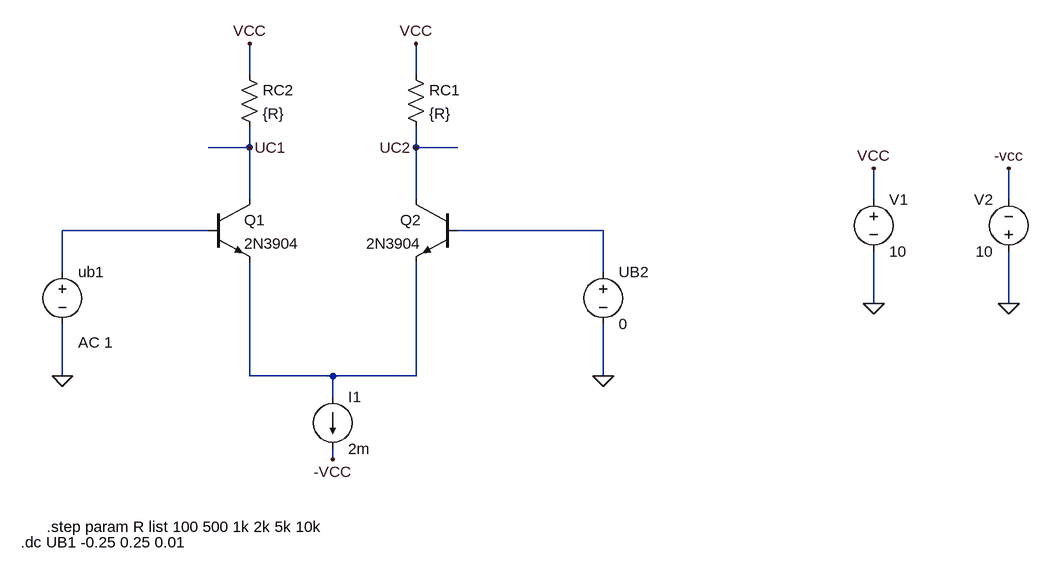
[diagram p0: schematic meros 4o B).asc]
meros 4o B).asc, the LTspice schematic file:
Version 4
SHEET 1 996 704
WIRE -208 -32 -208 -80
WIRE 48 -32 48 -80
WIRE -208 80 -208 48
WIRE -208 80 -272 80
WIRE 48 80 48 48
WIRE 112 80 48 80
WIRE -208 160 -208 80
WIRE 48 160 48 80
WIRE 752 160 752 112
WIRE 960 160 960 112
WIRE -272 208 -496 208
WIRE 336 208 112 208
WIRE -496 272 -496 208
WIRE 336 272 336 208
WIRE 752 320 752 240
WIRE 960 320 960 240
WIRE -496 432 -496 352
WIRE -208 432 -208 256
WIRE -80 432 -208 432
WIRE 48 432 48 256
WIRE 48 432 -80 432
WIRE 336 432 336 352
WIRE -80 464 -80 432
WIRE -80 560 -80 544
FLAG 752 320 0
FLAG 752 112 VCC
FLAG 48 -80 VCC
FLAG -208 -80 VCC
FLAG -208 80 UC1
FLAG 48 80 UC2
FLAG -80 560 -VCC
FLAG 960 112 -vcc
FLAG 960 320 0
FLAG 336 432 0
FLAG -496 432 0
SYMBOL npn -272 160 R0
SYMATTR InstName Q1
SYMATTR Value 2N3904
SYMBOL npn 112 160 M0
SYMATTR InstName Q2
SYMATTR Value 2N3904
SYMBOL res 32 -48 R0
SYMATTR InstName RC1
SYMATTR Value {R}
SYMBOL res -224 -48 R0
SYMATTR InstName RC2
SYMATTR Value {R}
SYMBOL voltage 336 256 R0
SYMATTR InstName UB2
SYMATTR Value 0
SYMBOL voltage 752 144 R0
SYMATTR InstName V1
SYMATTR Value 10
SYMBOL current -80 464 R0
SYMATTR InstName I1
SYMATTR Value 2m
SYMBOL voltage -496 256 R0
WINDOW 123 24 124 Left 2
WINDOW 39 0 0 Left 0
WINDOW 3 24 44 Left 2
SYMATTR Value2 AC 1
SYMATTR Value ""
SYMATTR InstName ub1
SYMBOL voltage 960 256 R180
WINDOW 0 24 96 Left 2
WINDOW 3 24 16 Left 2
SYMATTR InstName V2
SYMATTR Value 10
TEXT -520 664 Left 2 !.step param R list 100 500 1k 2k 5k 10k
TEXT -560 688 Left 2 !.dc UB1 -0.25 0.25 0.01

The netlist it stands for:
* meros 4o B).asc
Q1 UC1 N001 N003 0 2N3904
Q2 UC2 N002 N003 0 2N3904
RC1 VCC UC2 {R}
RC2 VCC UC1 {R}
V§UB2 N002 0 0
V1 VCC 0 10
I1 N003 -VCC 2m
V§ub1 N001 0 AC 1
V2 0 -VCC 10
.model NPN NPN
.model PNP PNP
.lib standard.bjt
.step param R list 100 500 1k 2k 5k 10k
.dc UB1 -0.25 0.25 0.01
.backanno
.end